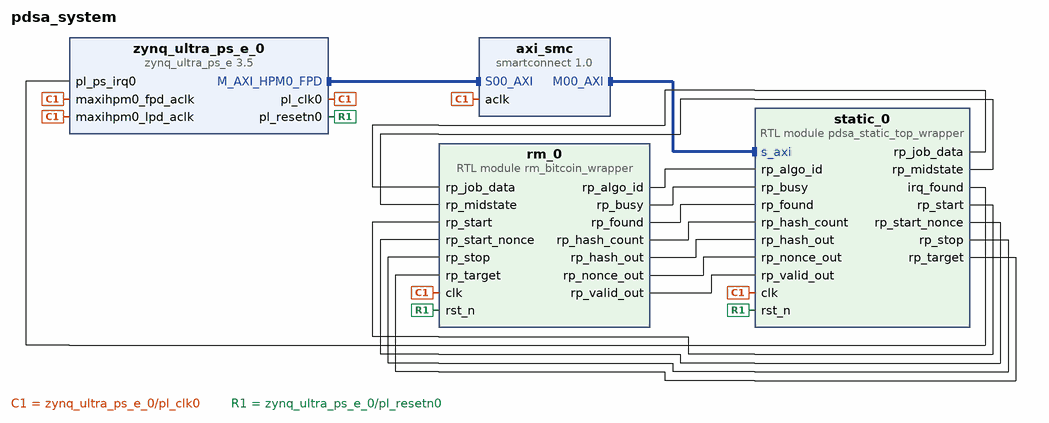
[diagram p0: block diagram of the top level]
# Vivado block design pdsa_system, xck26-sfvc784-2LV-c, Vivado 2025.2
create_bd_design pdsa_system

create_bd_cell -type ip -vlnv xilinx.com:ip:zynq_ultra_ps_e:3.5 zynq_ultra_ps_e_0
set_property -dict [list \
  CONFIG.PSU__CRL_APB__PL0_REF_CTRL__FREQMHZ 100 \
  CONFIG.PSU__DDR_HIGH_ADDRESS_GUI_ENABLE 0 \
  CONFIG.PSU__FPGA_PL0_ENABLE 1 \
  CONFIG.PSU__MAXIGP0__DATA_WIDTH 128 \
  CONFIG.PSU__USE__IRQ0 1 \
  CONFIG.PSU__USE__M_AXI_GP0 1 \
] [get_bd_cells zynq_ultra_ps_e_0]
# 27 more settings of zynq_ultra_ps_e_0 are not shown: defaults, MIO pin electricals, DDR timing, and values the tool derives
create_bd_cell -type ip -vlnv xilinx.com:ip:smartconnect:1.0 axi_smc
set_property -dict {CONFIG.NUM_MI 1 CONFIG.NUM_SI 1} [get_bd_cells axi_smc]
create_bd_cell -type module -reference pdsa_static_top_wrapper static_0
create_bd_cell -type module -reference rm_bitcoin_wrapper rm_0

# ---- connections ----

connect_bd_intf_net [get_bd_intf_pins axi_smc/M00_AXI] [get_bd_intf_pins static_0/s_axi]
connect_bd_intf_net [get_bd_intf_pins zynq_ultra_ps_e_0/M_AXI_HPM0_FPD] [get_bd_intf_pins axi_smc/S00_AXI]
connect_bd_net [get_bd_pins rm_0/rp_algo_id] [get_bd_pins static_0/rp_algo_id]
connect_bd_net [get_bd_pins rm_0/rp_busy] [get_bd_pins static_0/rp_busy]
connect_bd_net [get_bd_pins rm_0/rp_found] [get_bd_pins static_0/rp_found]
connect_bd_net [get_bd_pins rm_0/rp_hash_count] [get_bd_pins static_0/rp_hash_count]
connect_bd_net [get_bd_pins rm_0/rp_hash_out] [get_bd_pins static_0/rp_hash_out]
connect_bd_net [get_bd_pins rm_0/rp_nonce_out] [get_bd_pins static_0/rp_nonce_out]
connect_bd_net [get_bd_pins rm_0/rp_valid_out] [get_bd_pins static_0/rp_valid_out]
connect_bd_net [get_bd_pins static_0/irq_found] [get_bd_pins zynq_ultra_ps_e_0/pl_ps_irq0]
connect_bd_net [get_bd_pins static_0/rp_job_data] [get_bd_pins rm_0/rp_job_data]
connect_bd_net [get_bd_pins static_0/rp_midstate] [get_bd_pins rm_0/rp_midstate]
connect_bd_net [get_bd_pins static_0/rp_start] [get_bd_pins rm_0/rp_start]
connect_bd_net [get_bd_pins static_0/rp_start_nonce] [get_bd_pins rm_0/rp_start_nonce]
connect_bd_net [get_bd_pins static_0/rp_stop] [get_bd_pins rm_0/rp_stop]
connect_bd_net [get_bd_pins static_0/rp_target] [get_bd_pins rm_0/rp_target]
connect_bd_net [get_bd_pins zynq_ultra_ps_e_0/pl_clk0] \
  [get_bd_pins static_0/clk] [get_bd_pins rm_0/clk] [get_bd_pins axi_smc/aclk] \
  [get_bd_pins zynq_ultra_ps_e_0/maxihpm0_fpd_aclk] [get_bd_pins zynq_ultra_ps_e_0/maxihpm0_lpd_aclk]
connect_bd_net [get_bd_pins zynq_ultra_ps_e_0/pl_resetn0] [get_bd_pins static_0/rst_n] [get_bd_pins rm_0/rst_n]

# ---- address map ----
assign_bd_address -offset 0x00A0000000 -range 64K -target_address_space [get_bd_addr_spaces zynq_ultra_ps_e_0/Data] [get_bd_addr_segs static_0/s_axi/reg0]

validate_bd_design
save_bd_design
